# Altium schematic sheet ECGAquisitionBoard-SCH.SchDoc
size A; SheetNumber: 1; SheetTotal: 1
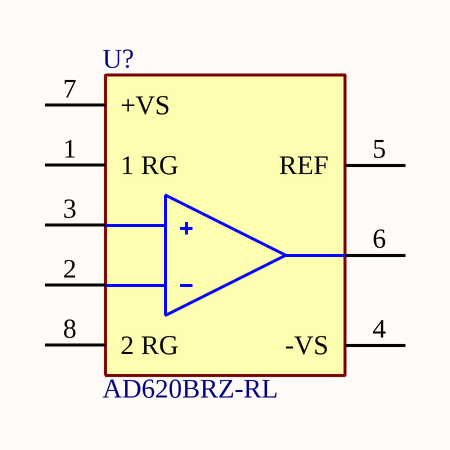
[diagram p0: ECGAquisitionBoard-SCH.SchDoc]

## Parts
U?  AD620BRZ-RL  [FP-R-8-IPC_A]

## Nets

Not connected (* = marked no-connect by the designer): U? 1(1_RG) 2(-IN) 3(+IN) 4(-VS) 5(REF) 6(OUTPUT) 7(+VS) 8(2_RG)

## Library data of the parts
U? = CMP-09116-000146-1: IC INST AMP 1 CIRCUIT 8SOIC; Number of Circuits: 1; Power Dissipation: 650mW; Amplifier Type: INSTRUMENTATION AMPLIFIER; Input Resistance: 10GR; -3db Bandwidth: 1MHz; Min Supply Voltage: 4.6V; Operating Supply Current: 1.3mA; Slew Rate: 1.2V/µs; Min Dual Supply Voltage: 2.3V; Input Offset Voltage (Vos): 30mV; Common Mode Rejection Ratio: 93dB; Output Current per Channel: 18mA; Operating Supply Voltage: 18V; Input Bias Current: 1nA; Mount: Surface Mount; Min Operating Temperature: -55°C; Series: -; RoHS Compliant: Yes; Lead Free: Contains Lead; Nominal Supply Current: 1.3mA; Number of Elements: 1; Packaging: Tape and Reel; Package Quantity: 2500; Number of Pins: 8; Max Operating Temperature: 125°C; Number of Channels: 1; Case/Package: SOIC; Contact Plating: Tin; Radiation Hardening: No; Max Power Dissipation: 650mW; Max Dual Supply Voltage: 18V